# Altium schematic sheet 5_Keys_And_Status.SchDoc: KEYS AND STATUS
size A4; ApprovedBy: Alcatraz; CheckedBy: Alcatraz; Author: Alcatraz; CompanyName: DHNLAB; DrawnBy: Alcatraz; Engineer: Alcatraz; Organization: DHNLAB PVT LTD; Address1: DHANBAD; Address2: JHARKHAND; Address3: INDIA; Address4: ASIA; DocumentNumber: 5; Revision: 1.0; SheetNumber: 5; SheetTotal: 10; ProjectTitle: ESP8266-Deskop_Power
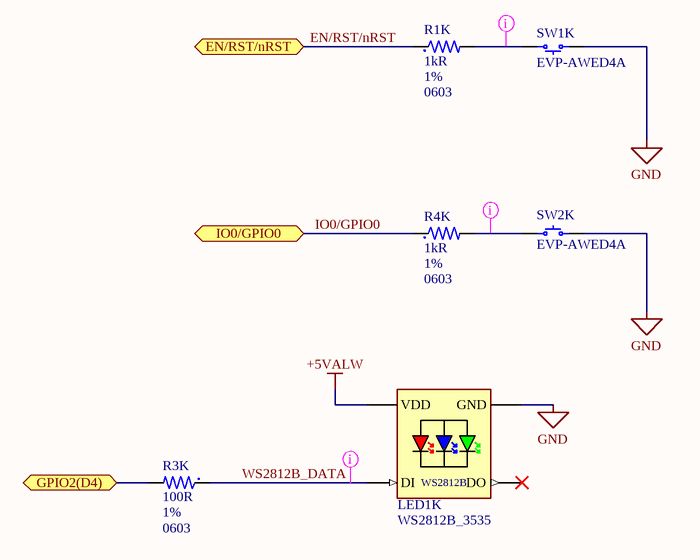
[diagram p0: 5_Keys_And_Status.SchDoc]

## Parts
LED1K  WS2812B_3535  [WS2812B-Mini_3535]
R1K  value 1kR  Tolerance: 1%  Case/Package: 0603  [R0603-MFG]  (hidden comment: RC0603FR-101KL)
R3K  value 100R  Tolerance: 1%  Case/Package: 0603  [R0603-MFG]  (hidden comment: AC0603FR-07100RL)
R4K  value 1kR  Tolerance: 1%  Case/Package: 0603  [R0603-MFG]  (hidden comment: RC0603FR-101KL)
SW1K  EVP-AWED4A  [PANASONIC EVPAW]
SW2K  EVP-AWED4A  [PANASONIC EVPAW]

## Ports
EN/RST/nRST (bidir), GPIO2(D4) (bidir, see 3_ESP8266_Core[2B]), IO0/GPIO0 (bidir)

## Nets
+5VALW: LED1K.1(VDD)
GND: LED1K.3(GND) SW1K.1 SW2K.2
EN/RST/nRST: R1K.1 ; port EN/RST/nRST
GPIO2(D4): R3K.2 ; port GPIO2(D4)
IO0/GPIO0: R4K.1 ; port IO0/GPIO0
WS2812B_DATA: LED1K.4(DI) R3K.1
NetR1K_2: R1K.2 SW1K.2
NetR4K_2: R4K.2 SW2K.1

Not connected (* = marked no-connect by the designer): LED1K 2(DO)*

## Layout directives
net class Digital_Signal_Low_Speed; net class Signal_75_ohm: NetR1K_2, NetR4K_2, WS2812B_DATA

## Notes on the sheet
- Title:
- Author:
- Approved:
- Size:
- Date:
- Git Hash:
- A4
- Prj:
- SW Version:
- Variant:
- Edited:
- PUBLIC
- File:

## Library data of the parts
LED1K = WS2812B_3535: 4 PIN SMART LED / WS2812 BODY 3.5MM X 3.5MM; MF: SparkFun Electronics; Availability: Unavailable; SnapEDA_Link: https://www.snapeda.com/parts/WS2812B/Worldsemi/view-part/1038297/?ref=snap; MP: WS2812B; Price: None; Value: *; Package: None
R1K R4K = 1K: SMD Chip Resistor, 1 kOhm, ± 1%, 100 mW, 0603 [1608 Metric], Thick Film, General Purpose; Manufacturer: Yageo; Power Rating: 100mW; Voltage Rating: 50V; Temperature Coefficient: 100ppm/°C; Supplier 1: Arrow Electronics; Manufacturer Part Number: RC0603FR-101KL; RoHS: Yes; Category: Chip SMD Resistors; Stock 1: 4; Pricing 1: 1=0.0018 (USD); Pins: 2NUMBER; Case Code (Metric): 1608; Case Code (Imperial): 0603; Contact Plating: Tin,Lead; Min Operating Temperature: -55°C; Max Operating Temperature: 155°C; Packaging: Tape and Reel; Resistor Type: Thick Film; Termination: SMD/SMT; Series: RC; Resistance Tolerance: 1%; Voltage Rating (DC): 50V; Length: 1.6mm; Width: 0.8mm; Height: 0.45mm; Reach SVHC Compliant: Unknown; RoHS Compliant: Yes; Supplier Part Number 1: RC0603FR-101KL; ComponentLink1URL: https://datasheet.ciiva.com/7983/443971-7983659.pdf?src-supplier=Element14; ComponentLink1Description: https://datasheet.ciiva.com/7983/443971-7983659.pdf?src-supplier=Element14; ComponentLink2URL: https://datasheet.ciiva.com/12560/rc0603-272842-12560633.pdf?src-supplier=Mouser; ComponentLink2Description: https://datasheet.ciiva.com/12560/rc0603-272842-12560633.pdf?src-supplier=Mouser
R3K = 100R: SMD Chip Resistor, 100 Ohm, ± 1%, 100 mW, 0603 [1608 Metric], Thick Film, General Purpose; Manufacturer: Yageo; Power Rating: 100mW; Voltage Rating: 50V; Temperature Coefficient: 100ppm/°C; Supplier 1: Future Electronics; Manufacturer Part Number: AC0603FR-07100RL; RoHS: Yes; Category: Chip SMD Resistors; Stock 1: 1675000; Pricing 1: 5000=0.0027, 50000=0.0025, 150000=0.0024, 375000=0.0023, 1000000=0.0022 (USD); Case Code (Metric): 1608; Contact Plating: Tin,Matte; Min Operating Temperature: -55°C; Max Operating Temperature: 155°C; Packaging: Tape and Reel; Height: 0.45mm; RoHS Compliant: Yes; ComponentLink1URL: https://datasheet.ciiva.com/12576/pyu-ac-51-rohs-l-2-12576586.pdf?src-supplier=Mouser; ComponentLink1Description: https://datasheet.ciiva.com/12576/pyu-ac-51-rohs-l-2-12576586.pdf?src-supplier=Mouser; Supplier Part Number 1: 2026405; Case Code (Imperial): 0603; Series: AC; Termination: SMD/SMT; Length: 1.6mm; Width: 0.8mm; Weight: 7.1E-05oz; Number of Terminations: 2; Max Power Dissipation: 100mW; Features: Moisture Resistant,Automotive AEC-Q200; Ratings: AEC-Q200; Lead Free: 5697LeadFree
SW1K SW2K = EVP-AWED4A: 3.0MM X 2.0MM / 3.3N / 0.15MM ST; Manufacturer: Panasonic Electronic Components; Actuator Height off PCB, Vertical: 0.60mm; Actuator Orientation: Top Actuated; Actuator Type: Standard; Circuit: SPST-NO; Contact Rating @ Voltage: 0.02A @ 15VDC; Illumination: Non-Illuminated; Ingress Protection: IP67 - Dust Tight, Waterproof; Operating Force: 330gf; Outline: 3.00mm x 2.00mm; Switch Function: Off-Mom; Part Number: EVP-AWED4A; ComponentLink1Description: Datasheet; ComponentLink1URL: https://industrial.panasonic.com/ac/cdn/e/control/switch/light-touch/catalog/sw_lt_eng_3020s.pdf; ComponentLink2Description: DigiKey Link; ComponentLink2URL: https://www.digikey.com/en/products/detail/panasonic-electronic-components/EVP-AWED4A/8568275; LastUpdated: 03-06-2024 20:19:31; Lifecycle Status: Active; Minimum Order: 1; Mounting Type: Surface Mount; Operating Temperature: -40°C ~ 85°C; Packaging: TapeAndReel; Part Status: Active; Price: 0.16; Series: EVPAW; Supplier 1: DigiKey; Supplier Part Number 1: P123440CT-ND; Termination Style: SMD (SMT) Tab